# EAGLE design Boost converter (EAGLE 7.2.0)
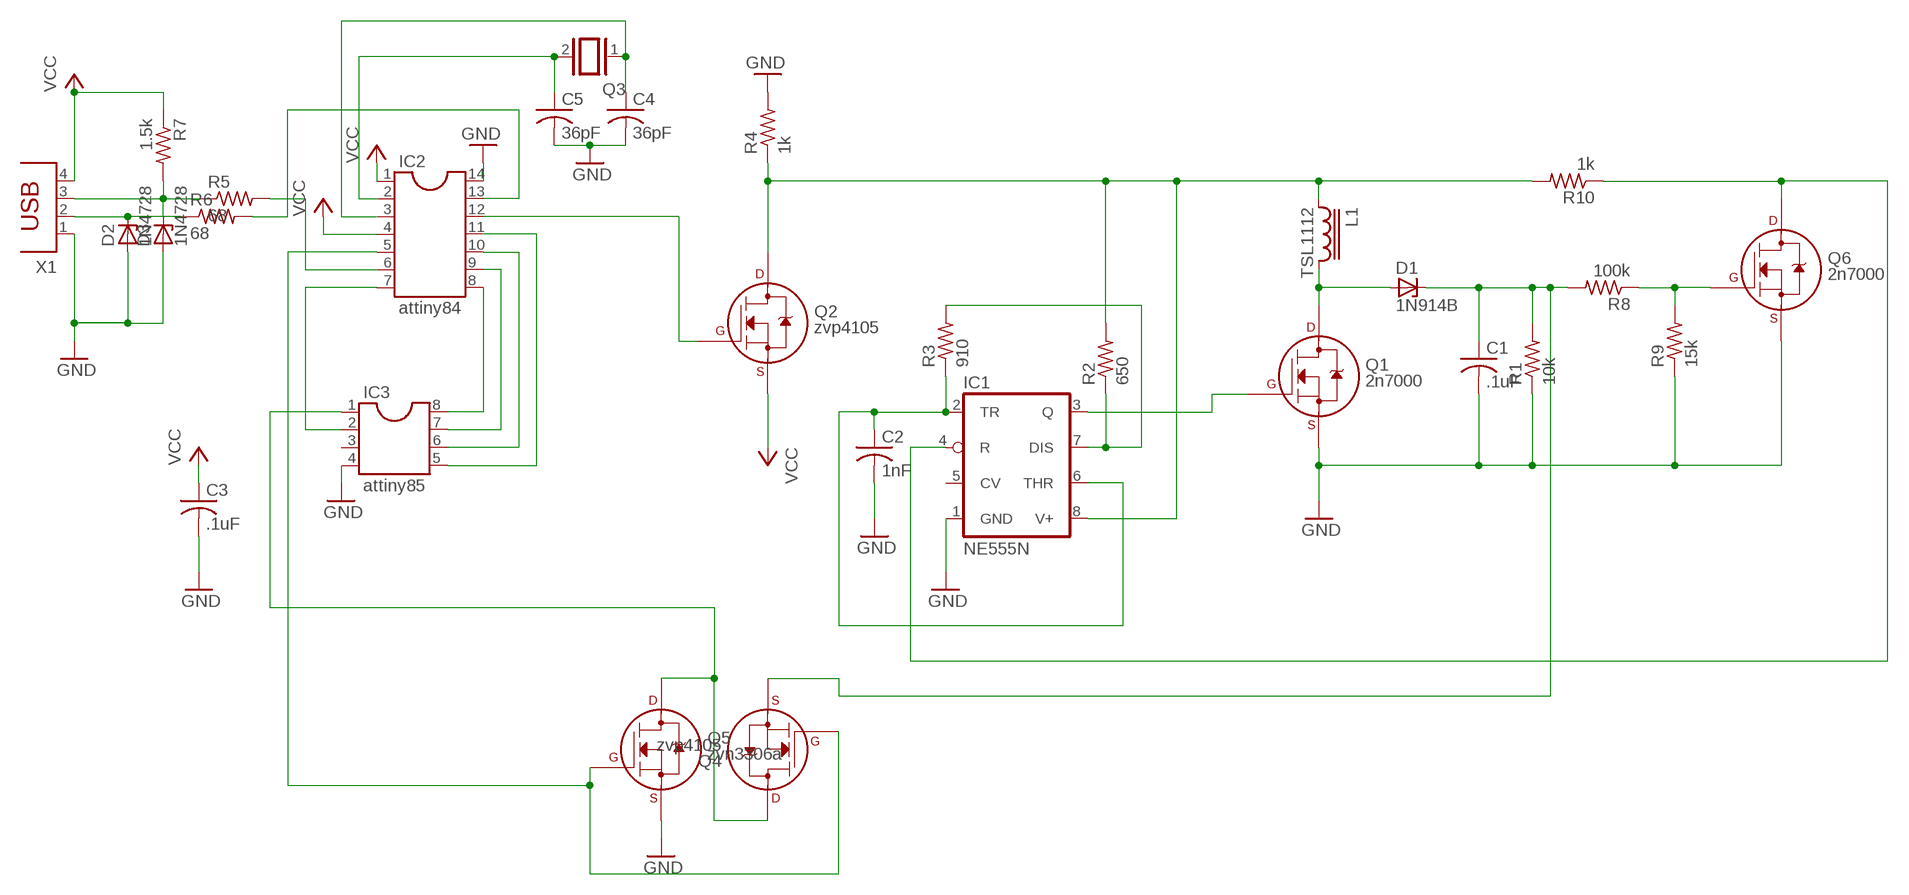
[diagram p0: schematic, sheet 1]

## Parts
C1  .1uF  C-US025-024X044  [C025-024X044]
C2  1nF  C-US025-024X044  [C025-024X044]
C3  .1uF  C-US025-024X044  [C025-024X044]
C4  36pF  C-US025-024X044  [C025-024X044]
C5  36pF  C-US025-024X044  [C025-024X044]
D1  1N914B  1N4728  [DO41Z10]
D2  1N4728  [DO41Z10]
D3  1N4728  [DO41Z10]
IC1  NE555N  [DIL08-ROUND]
IC2  attiny84  DIL14  [DIL14]
IC3  attiny85  DIL8S  [SOCKET-08]
L1  TSL1112  [TSL1112]
Q1  2n7000  2N7000_TO92  [TO-92]
Q2  zvp4105  2N7000_TO92  [TO-92]
Q3  XTAL/S  [QS]
Q4  zvp4105  2N7000_TO92  [TO-92]
Q5  zvn3306a  2N7000_TO92  [TO-92]
Q6  2n7000  2N7000_TO92  [TO-92]
R1  10k  R-US_0204/7  [0204/7]
R2  650  R-US_0204/7  [0204/7]
R3  910  R-US_0204/7  [0204/7]
R4  1k  R-US_0204/7  [0204/7]
R5  68  R-US_0204/7  [0204/7]
R6  68  R-US_0204/7  [0204/7]
R7  1.5k  R-US_0204/7  [0204/7]
R8  100k  R-US_0204/7  [0204/7]
R9  15k  R-US_0204/7  [0204/7]
R10  1k  R-US_0204/7  [0204/7]
X1  PN87520  [PN87520]

## Nets
GND: C1.2 C2.2 C3.2 C4.2 C5.2 D2.A D3.A IC1.1(GND) IC2.14 IC3.4 Q1.1(S) Q5.1(S) Q6.1(S) R1.1 R4.2 R9.1 X1.1
N$1: D2.C R6.1 X1.2
N$2: C5.1 IC2.2 Q3.2
N$3: C4.1 IC2.3 Q3.1
N$4: D3.C R5.1 R7.2 X1.3
N$5: IC2.6 R5.2
N$6: IC2.13 R6.2
N$7: IC1.8(V+) L1.1 Q2.3(D) R2.2 R4.1 R10.2
N$8: Q6.2(G) R8.1 R9.2
N$9: IC1.4(R) Q6.3(D) R10.1
N$10: IC2.12 Q2.2(G)
N$11: C1.1 D1.C Q4.1(S) R1.2 R8.2
N$12: IC1.3(Q) Q1.2(G)
N$13: IC1.7(DIS) R2.1 R3.2
N$14: C2.1 IC1.2(TR) IC1.6(THR) R3.1
N$15: D1.A L1.2 Q1.3(D)
N$16: IC3.1 Q4.3(D) Q5.3(D)
N$17: IC2.5 Q4.2(G) Q5.2(G)
N$19: IC2.8 IC3.8
N$20: IC2.9 IC3.7
N$21: IC2.10 IC3.6
N$22: IC2.11 IC3.5
N$23: IC2.7 IC3.2
VCC: C3.1 IC2.1 IC2.4 Q2.1(S) R7.1 X1.4
Unconnected: IC1.5(CV) IC3.3

## Library data of the parts
C1-C5 = resistor:C-US: CAPACITOR, American symbol
D1-D3 = diode:1N4728: Z DIODE 3.3 V, 1W, 5 percent
IC1 = adafruit:*555: TIMER Changed DIP package to have round (not oval) pin pads http://www.ladyada.net/library/pcb/eaglelibrary.html
IC2 = ic-package:DIL14: Dual In Line / Socket
IC3 = ic-package:DIL8: Dual In Line / Socket
L1 = inductors-tdk:TSL1112: POWER INDUCTOR
Q1 Q2 Q4-Q6 = transistor2:2N700*: 2N7000, 2N7002, NDS7002A N-channel enhancement mode MOSFET
Q3 = special:XTAL/S: CRYSTAL
R1-R10 = resistor:R-US_: RESISTOR, American symbol
X1 = con-berg:PN87520: BERG USB connector; OC_FARNELL: unknown; OC_NEWARK: unknown

## Board
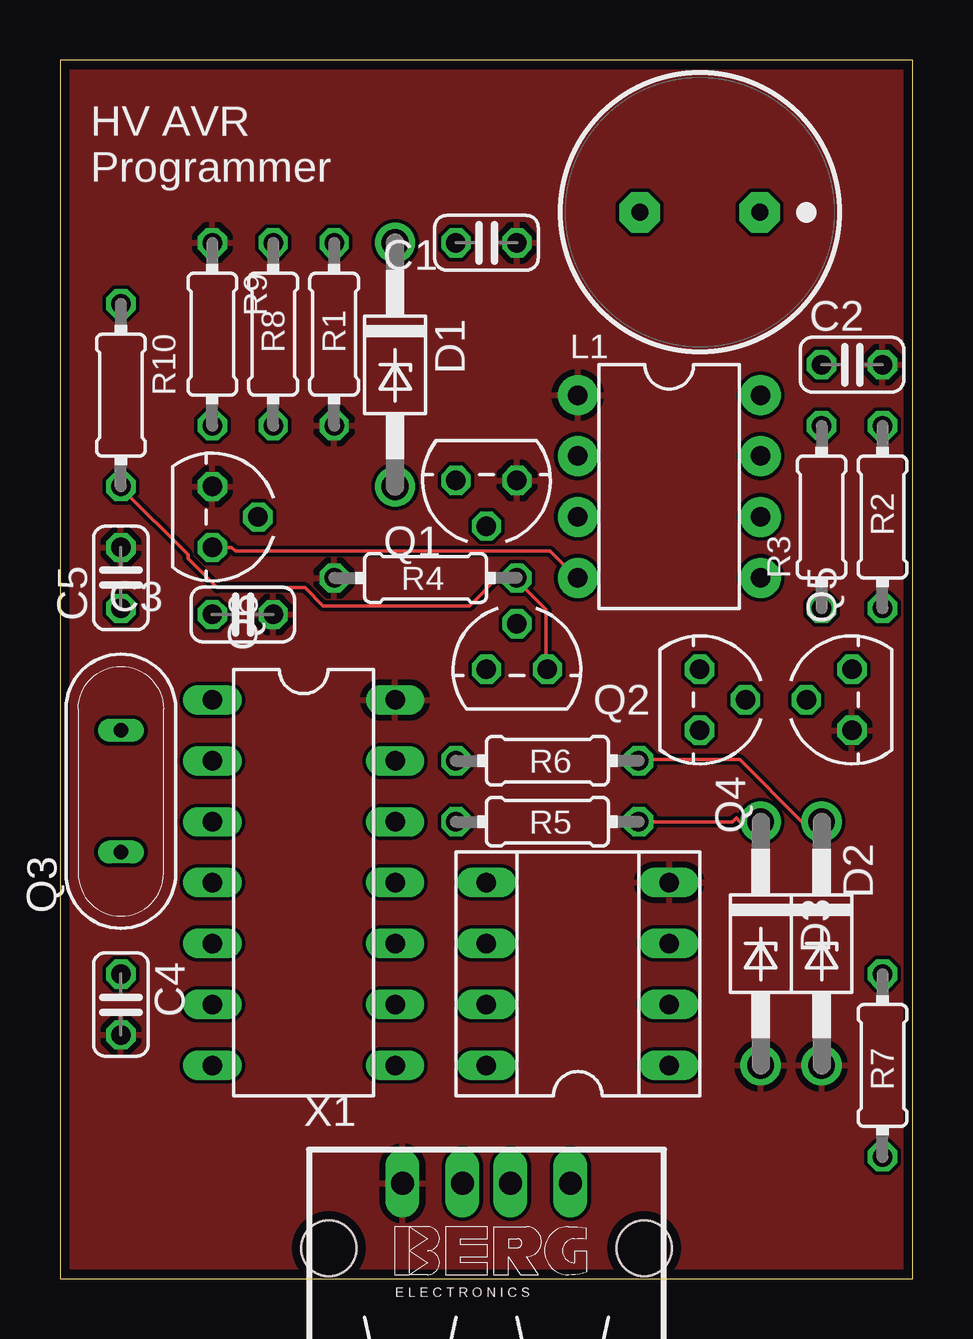
[diagram p1: board, top side]
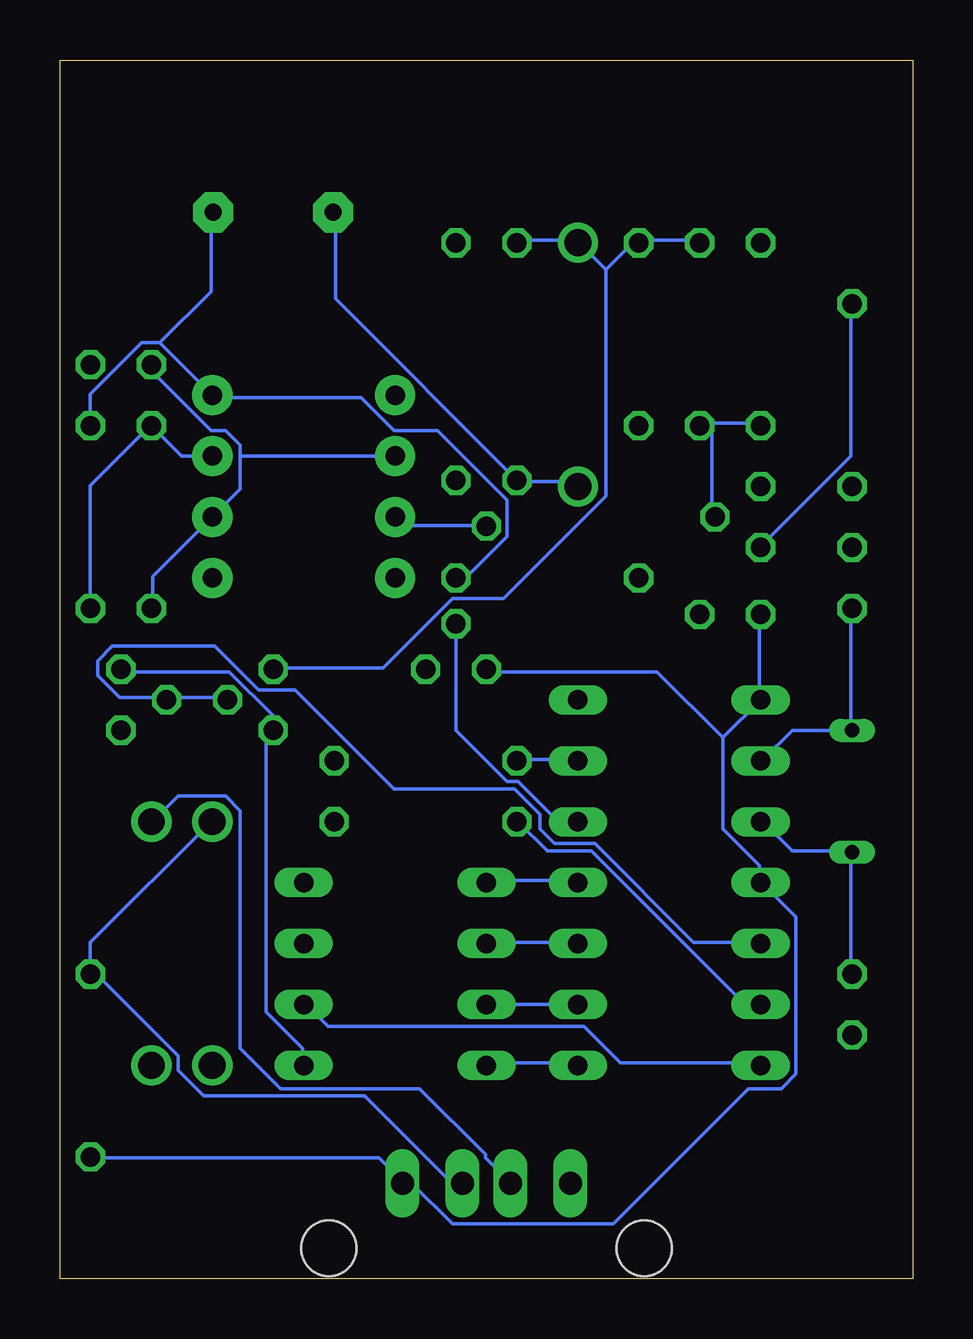
[diagram p2: board, bottom side, seen from below]

Size 35.56 x 50.8 mm. Coordinates in mm from the lower left corner, seen from the top.
Outline: 0,0 35.56,0 35.56,50.8 0,50.8 0,0
Copper layers (1*16): Top 0.0356mm / dielectric 1.5011mm / Bottom 0.0356mm
Design rules "oshparkPCB": minimum track width 6mil, minimum drill 13mil, track to track 6mil, track to pad 6mil, pad to pad 6mil, via to via 6mil, smd to smd 6mil, copper to edge 15mil, drill to drill 6mil, minimum pad ring 7mil, minimum via ring 7mil, stop-mask expansion 3mil, vias tented up to drill 0mil, thermal gap 10mil

### Footprints (pad centres in the part's own frame; a part is rotated, then mirrored left to right if it is on the bottom)
C025-024X044 = drill 0.813 octagon: 1 -1.27,0; 2 1.27,0
DO41Z10 = drill 1.118: A 5.08,0; C -5.08,0
DIL08-ROUND = drill 0.813 pad 1.676: 1 -3.81,-3.81; 2 -1.27,-3.81; 3 1.27,-3.81; 4 3.81,-3.81; 5 3.81,3.81; 6 1.27,3.81; 7 -1.27,3.81; 8 -3.81,3.81
DIL14 = drill 0.813 long: 1 -7.62,-3.81; 2 -5.08,-3.81; 3 -2.54,-3.81; 4 0,-3.81; 5 2.54,-3.81; 6 5.08,-3.81; 7 7.62,-3.81; 8 7.62,3.81; 9 5.08,3.81; 10 2.54,3.81; 11 0,3.81; 12 -2.54,3.81; 13 -5.08,3.81; 14 -7.62,3.81
SOCKET-08 = drill 0.813 long: 1 -3.81,-3.81; 2 -1.27,-3.81; 3 1.27,-3.81; 4 3.81,-3.81; 5 3.81,3.81; 6 1.27,3.81; 7 -1.27,3.81; 8 -3.81,3.81
TSL1112 = drill 0.711 pad 1.676 octagon: 1 -2.5,0; 2 2.5,0
TO-92 = drill 0.813 octagon: 1 -1.27,0; 2 0,1.905; 3 1.27,0
QS = drill 0.61 long: 1 -2.54,0; 2 2.54,0
0204/7 = drill 0.813 octagon: 1 -3.81,0; 2 3.81,0
PN87520 = drill 0.95 long: 1 -3.5,2.71; 2 -1,2.71; 3 1,2.71; 4 3.5,2.71 | hole 2.3: -6.57,0; 6.57,0

### Placement (x,y rotation side)
C1  17.78,43.18 0 top
C2  33.02,38.1 0 top
C3  7.62,27.69 0 top
C4  2.54,11.43 270 top
C5  2.54,29.21 90 top
D1  13.97,38.1 270 top
D2  31.75,13.97 270 top
D3  29.21,13.97 270 top
IC1  25.4,33.02 270 top
IC2  10.16,16.51 270 top
IC3  21.59,12.7 90 top
L1  26.67,44.45 180 top
Q1  17.78,33.27 180 top
Q2  19.05,25.4 0 top
Q3  2.54,20.32 90 top
Q4  26.67,24.13 270 top
Q5  33.02,24.13 90 top
Q6  6.35,31.75 270 top
R1  11.43,39.37 90 top
R2  34.29,31.75 90 top
R3  31.75,31.75 90 top
R4  15.24,29.21 180 top
R5  20.32,19.05 180 top
R6  20.32,21.59 180 top
R7  34.29,8.89 90 top
R8  8.89,39.37 90 top
R9  6.35,39.37 270 top
R10  2.54,36.83 270 top
X1  17.78,1.27 0 top

### Tracks (layer width: path | path; a pad name or v marks a point on that pad's centre or on a via)
GND
  pour Top: 0,0 35.56,0 35.56,50.8 0,50.8
N$1
  Top 0.152: D2.C 30.94,19.05 28.35,21.64 24.23,21.64 R6.1
  Bottom 0.152: X1.2 16.92,4.12 17.83,5.03 17.83,5.18 20.57,7.92 26.36,7.92 28.04,9.6 28.04,19.51 28.65,20.12 30.63,20.12 31.7,19.05 D2.C
N$2
  Bottom 0.152: 2.59,22.86 5.03,22.86 6.25,21.64 IC2.2 | 2.59,22.86 2.59,27.89 C5.1 | 2.59,22.86 Q3.2
N$3
  Bottom 0.152: IC2.3 6.25,19.05 5.03,17.83 2.59,17.83 Q3.1 2.59,17.68 2.59,12.8 C4.1
N$4
  Top 0.152: R5.1 28.04,19.05 28.19,19.2 28.35,19.05 D3.C
  Bottom 0.152: 34.29,12.95 34.29,14.02 29.26,19.05 D3.C | 34.29,12.95 R7.2 34.29,12.8 | 34.29,12.95 30.63,9.3 30.63,8.69 29.57,7.62 22.86,7.62 19.36,4.12 18.9,4.12 X1.3
N$5
  Bottom 0.152: IC2.6 7.01,11.43 13.41,17.83 15.24,17.83 16.46,19.05 R5.2
N$6
  Bottom 0.152: IC2.13 14.02,21.64 16.46,21.64 R6.2
N$7
  Top 0.152: R10.2 2.59,32.92 5.33,30.18 5.33,30.02 6.55,28.8 10.21,28.8 10.97,28.04 17.07,28.04 18.29,29.26 19.05,29.26 R4.1 19.05,29.11 20.27,27.89 20.27,25.45 Q2.3
  Bottom 0.152: R2.2 34.29,36.88 32.16,39.01 31.39,39.01 | 31.39,39.01 IC1.8 29.11,36.73 23.01,36.73 21.64,35.36 19.81,35.36 16.92,32.46 16.92,30.94 18.59,29.26 19.05,29.26 R4.1 | 31.39,39.01 29.26,41.15 29.26,44.35 L1.1
N$8
  Bottom 0.152: 8.38,35.66 8.84,35.66 R8.1 8.38,35.66 | 8.38,35.66 6.4,35.66 R9.2 | 8.38,35.66 8.38,31.85 Q6.2
N$9
  Top 0.152: Q6.3 7.16,30.48 7.32,30.33 20.42,30.33 21.49,29.26 IC1.4
  Bottom 0.152: R10.1 2.59,40.54 2.59,34.29 6.4,30.48 Q6.3
N$10
  Bottom 0.152: IC2.12 14.78,19.05 16.46,20.73 16.92,20.73 19.05,22.86 Q2.2
N$11
  Bottom 0.152: R8.2 8.99,43.28 11.43,43.28 R1.2 11.43,43.13 11.73,43.13 12.8,42.06 | C1.1 16.46,43.28 14.02,43.28 D1.C 13.87,43.13 12.8,42.06 | 12.8,42.06 12.8,32.61 17.07,28.35 19.2,28.35 22.1,25.45 26.67,25.45 Q4.1
N$12
  Bottom 0.152: Q1.2 17.83,31.39 21.18,31.39 21.49,31.7 IC1.3
N$13
  Bottom 0.152: R2.1 34.29,33.07 31.85,35.51 R3.2 30.48,34.29 IC1.7
N$14
  Bottom 0.152: R3.1 31.7,28.04 31.7,29.26 IC1.6 28.04,32.92 28.04,34.29 | 28.04,34.29 28.04,34.75 28.65,35.36 29.26,35.36 31.7,37.8 31.7,38.1 C2.1 | 28.04,34.29 IC1.2
N$15
  Bottom 0.152: D1.A 14.17,33.22 16.46,33.22 Q1.3 24.08,40.84 24.08,44.35 L1.2
N$16
  Bottom 0.152: IC3.1 25.45,8.99 25.45,9.6 26.98,11.12 26.98,22.55 Q4.3 26.67,23.47 28.5,25.3 32.92,25.3 Q5.3
N$17
  Bottom 0.152: IC2.5 6.4,14.02 9.14,14.02 13.26,18.14 14.94,18.14 15.54,18.75 15.54,19.36 16.61,20.42 21.64,20.42 25.76,24.54 27.28,24.54 29.11,26.36 33.38,26.36 33.98,25.76 33.98,25.15 33.07,24.23 31.24,24.23 Q5.2 31.09,24.23 28.65,24.23 Q4.2
N$19
  Bottom 0.152: IC2.8 14.02,8.99 17.68,8.99 IC3.8
N$20
  Bottom 0.152: IC3.7 IC2.9
N$21
  Bottom 0.152: IC2.10 14.02,14.02 17.68,14.02 IC3.6
N$22
  Bottom 0.152: IC2.11 14.02,16.61 17.68,16.61 IC3.5
N$23
  Bottom 0.152: IC2.7 6.4,8.99 12.19,8.99 13.72,10.52 24.38,10.52 25.3,11.43 IC3.2
VCC
  Bottom 0.152: R7.1 34.29,5.03 22.25,5.03 21.34,4.12 X1.4 21.18,3.96 20.88,3.96 19.2,2.29 12.5,2.29 6.86,7.92 5.49,7.92 4.88,8.53 4.88,15.09 6.25,16.46 IC2.4 6.4,16.61 6.4,17.22 7.92,18.75 7.92,22.55 | 7.92,22.55 IC2.1 6.4,24.23 6.4,27.58 C3.1 | 7.92,22.55 10.67,25.3 17.68,25.3 Q2.1

### Text on the board
tPlace: HV AVR / Programmer